# Altium schematic sheet sch_station_de_charge_r.SchDoc
size A3; SheetNumber: 2; SheetTotal: 2
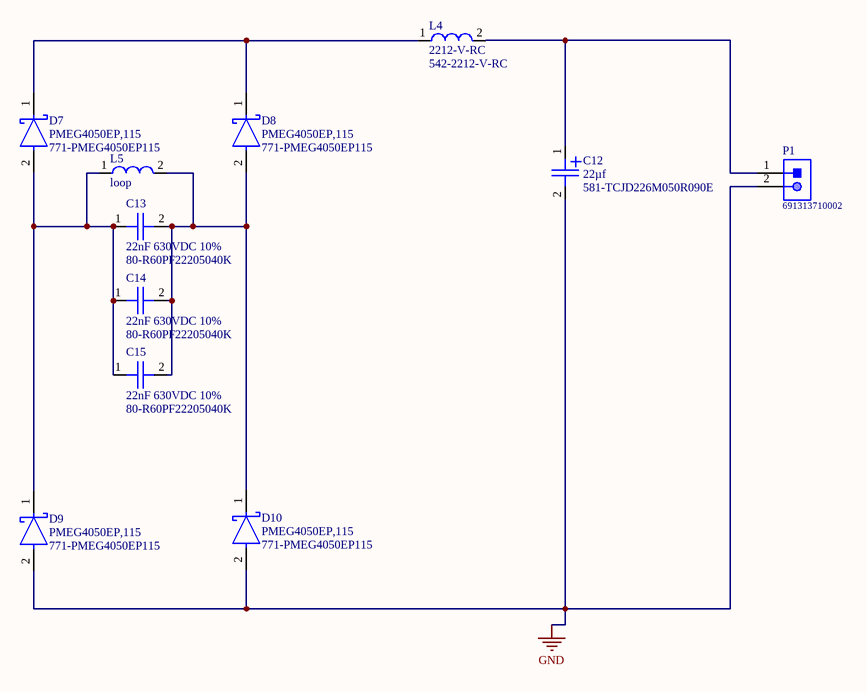
[diagram p0: sch_station_de_charge_r.SchDoc]

## Parts
C12  22µf  Supplier Part Number 1: 581-TCJD226M050R090E  [CAPPM7343X310N]
C13  22nF 630VDC 10%  Supplier Part Number 1: 80-R60PF22205040K  [R60PF22205040K]
C14  22nF 630VDC 10%  Supplier Part Number 1: 80-R60PF22205040K  [R60PF22205040K]
C15  22nF 630VDC 10%  Supplier Part Number 1: 80-R60PF22205040K  [R60PF22205040K]
D7  PMEG4050EP,115  Supplier Part Number 1: 771-PMEG4050EP115  [FP-SOD128-MFG]
D8  PMEG4050EP,115  Supplier Part Number 1: 771-PMEG4050EP115  [FP-SOD128-MFG]
D9  PMEG4050EP,115  Supplier Part Number 1: 771-PMEG4050EP115  [FP-SOD128-MFG]
D10  PMEG4050EP,115  Supplier Part Number 1: 771-PMEG4050EP115  [FP-SOD128-MFG]
L4  2212-V-RC  Supplier Part Number 1: 542-2212-V-RC  [IND_HCTI-220-5.8]
L5  loop  [loop]
P1  691313710002  [691313710002]

## Nets
GND: C12.2 D9.2(A) D10.2(A) P1.2
NetC12_1: C12.1 L4.2 P1.1
NetC13_1: C13.1 C14.1 C15.1 D7.2(A) D9.1(K) L5.1
NetC13_2: C13.2 C14.2 C15.2 D8.2(A) D10.1(K) L5.2
NetD7_1: D7.1(K) D8.1(K) L4.1

## Library data of the parts
C12 = TCJD226M050R0090E: Cap Tant Polymer 22uF 50VDC D CASE 20% (7.3 X 4.3 X 2.9mm) SMD 7343-31 0.09 Ohm 125C Automotive T/R; Manufacturer: Kyocera AVX; Manufacturer Part Number: TCJD226M050R0090E; RoHS: Yes; Stock 1: 3975; Pricing 1: 1=3,75000, 10=3,03000, 50=2,65000, 100=2,32000, 500=2,03000, 1000=2,03000, 10000=2,03000 (USD); Supplier 1: Mouser
C13-C15 = R60PF22205040K: Cap Film 0.022uF 630V PET 10%( 13 X 4 X 9mm) Radial Wound 10mm 105C Automotive Bag; Manufacturer: KEMET; Voltage Rating (AC): 220V; Supplier 1: Mouser; Manufacturer Part Number: R60PF22205040K; RoHS: Yes; Category: Film Capacitors; Stock 1: 1035; Pricing 1: 1=0,67000, 10=0,49600, 50=0,39700, 100=0,34000, 1000=0,22700, 10000=0,21200 (USD); Mount: Through Hole; Case/Package: Radial; Dielectric Material: PET; Min Operating Temperature: -55°C; Max Operating Temperature: 105°C; Capacitance: 22nF; Packaging: Bulk; Voltage Rating (DC): 630V; Dielectric: PET; Termination: PC Pins; Voltage Rating: 630V; Tolerance: 10%; Length: 0.512inch; Width: 0.157inch; Height - Seated (Max): 0.394inch; Lead Pitch: 0.394inch; REACH SVHC: No SVHC; RoHS Compliant: Yes; ComponentLink1URL: http://www.farnell.com/datasheets/1959821.pdf?src-supplier=Farnell; ComponentLink1Description: http://www.farnell.com/datasheets/1959821.pdf?src-supplier=Farnell; ComponentLink2URL: http://www.farnell.com/datasheets/1959821.pdf?src-supplier=Element14; ComponentLink2Description: http://www.farnell.com/datasheets/1959821.pdf?src-supplier=Element14; ComponentLink3URL: http://www.kemet.com/docfinder?Partnumber=R60&src-supplier=Digi-Key; ComponentLink3Description: http://www.kemet.com/docfinder?Partnumber=R60&src-supplier=Digi-Key
D7-D10 = PMEG4050EP,115: DIODE SCHOTTKY 40V 5A SOD128; Manufacturer: Nexperia; Supplier 1: Mouser; Manufacturer Part Number: PMEG4050EP,115; RoHS: Yes; Category: Rectifier Diodes; Stock 1: 216619; Pricing 1: 1=0,55000, 10=0,47100, 50=0,47100, 100=0,35200, 1000=0,21400, 10000=0,17700 (USD); RoHS Compliant: Yes; ComponentLink1URL: http://www.farnell.com/datasheets/609330.pdf?src-supplier=Farnell; ComponentLink1Description: http://www.farnell.com/datasheets/609330.pdf?src-supplier=Farnell; ComponentLink2URL: http://www.farnell.com/datasheets/609330.pdf?src-supplier=Element14; ComponentLink2Description: http://www.farnell.com/datasheets/609330.pdf?src-supplier=Element14; ComponentLink3URL: https://www.mouser.com/ds/2/302/PMEG4050EP-1151641.pdf?src-supplier=Mouser; ComponentLink3Description: https://www.mouser.com/ds/2/302/PMEG4050EP-1151641.pdf?src-supplier=Mouser; ComponentLink4URL: http://www.farnell.com/datasheets/609330.pdf?src-supplier=Newark; ComponentLink4Description: http://www.farnell.com/datasheets/609330.pdf?src-supplier=Newark; ComponentLink5URL: https://assets.nexperia.com/documents/data-sheet/PMEG4050EP.pdf?src-supplier=Digi-Key; ComponentLink5Description: https://assets.nexperia.com/documents/data-sheet/PMEG4050EP.pdf?src-supplier=Digi-Key
L4 = 2212-V-RC: Inductor High Current Toroid 100uH/64uH 15% 1KHz 4.4A 56mOhm DCR RDL; Manufacturer: Bourns JW Miller; Core Material: Ferrite; Lead/Base Style: Radial; Inductance: 100uH; Shielding: Shielded; DC Resistance (DCR): 56mR; Lead Diameter: 0.86mm; Supplier 1: Mouser; Manufacturer Part Number: 2212-V-RC; RoHS: Yes; Category: Fixed Inductors; Stock 1: 1501; Pricing 1: 1=4,88000, 10=4,48000, 50=3,72000, 100=2,93000, 1000=2,93000, 10000=2,93000 (USD); Mount: Through Hole,Radial; Case/Package: Radial; Number of Pins: 2; Contact Plating: Tin; Min Operating Temperature: -55°C; Max Operating Temperature: 105°C; Tolerance: 15%; Test Frequency: 1kHz; Inductance Tolerance: 15%; Current Rating: 4.4A; Package Quantity: 77; Packaging: Bulk; Max DC Current: 4.4A; Termination: Radial; DC Current: 4.4A; RMS Current (Irms): 4.4A; Series: 2200; Diameter: 0.95inch; Width: 0.55inch; Lead Pitch: 11.176mm; Height - Seated (Max): 0.55inch; Depth: 13.97mm; Radiation Hardening: No; REACH SVHC: No SVHC; Military Standard: Not; Lead Free: Lead Free; RoHS Compliant: Yes; ComponentLink1URL: https://datasheet.ciiva.com/11798/0900766b80fa5688-11798051.pdf?src-supplier=RSComponents; ComponentLink1Description: https://datasheet.ciiva.com/11798/0900766b80fa5688-11798051.pdf?src-supplier=RSComponents; ComponentLink2URL: https://datasheet.ciiva.com/6690/2200-series-6690646.pdf?src-supplier=Digi-Key; ComponentLink2Description: https://datasheet.ciiva.com/6690/2200-series-6690646.pdf?src-supplier=Digi-Key; ComponentLink3URL: https://datasheet.ciiva.com/28654/2200-series-28654982.pdf?src-supplier=Element14; ComponentLink3Description: https://datasheet.ciiva.com/28654/2200-series-28654982.pdf?src-supplier=Element14; ComponentLink4URL: https://datasheet.ciiva.com/3076/2200-series-3076522.pdf?src-supplier=Avnet; ComponentLink4Description: https://datasheet.ciiva.com/3076/2200-series-3076522.pdf?src-supplier=Avnet
P1 = CMP-1502-02048-1: Serie 3137 - 5.00mm Close Horizontal PCB Header WR-TBL, 2 pin; Manufacturer: Wurth Elektronik; Gender: Male; Pin Number: 2; Operating Temperature: -40to105degC; Manufacturer URL: http://www.we-online.de; Mounting Technology: THT; Package Reference: 691313710002; Part Number: 691313710002; Publisher: WurthElektronik; Packaging: Box; Datasheet URL: http://katalog.we-online.de/em/datasheet/6913137100xx.pdf; Pitch: 5.00mm